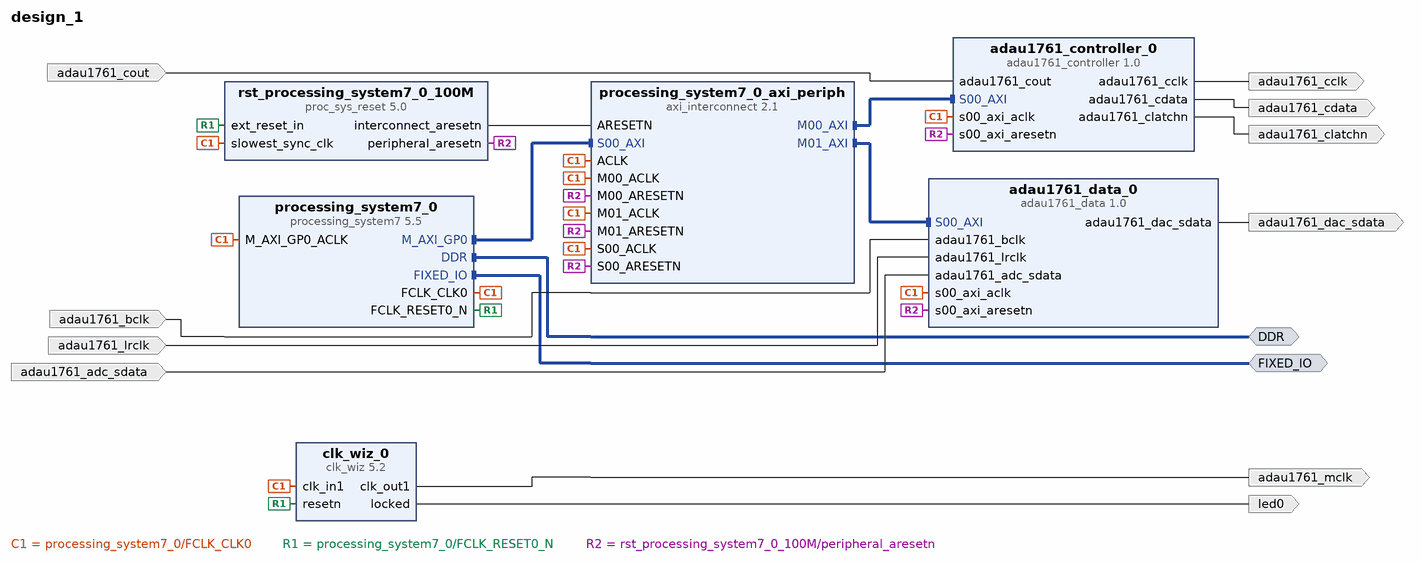
[diagram p0: block diagram of the top level]
# Vivado block design design_1, Vivado 2015.4
create_bd_design design_1

create_bd_intf_port -mode Master -vlnv xilinx.com:interface:ddrx_rtl:1.0 DDR
create_bd_intf_port -mode Master -vlnv xilinx.com:display_processing_system7:fixedio_rtl:1.0 FIXED_IO
create_bd_port -dir O adau1761_cclk
create_bd_port -dir O adau1761_clatchn
create_bd_port -dir O adau1761_cdata
create_bd_port -dir I adau1761_cout
create_bd_port -dir O adau1761_mclk
create_bd_port -dir O led0
create_bd_port -dir O adau1761_dac_sdata
create_bd_port -dir I adau1761_bclk
create_bd_port -dir I adau1761_lrclk
create_bd_port -dir I adau1761_adc_sdata

create_bd_cell -type ip -vlnv xilinx.com:ip:processing_system7:5.5 processing_system7_0
set_property -dict {CONFIG.preset ZedBoard} [get_bd_cells processing_system7_0]
create_bd_cell -type ip -vlnv xilinx.com:user:adau1761_controller:1.0 adau1761_controller_0
create_bd_cell -type ip -vlnv xilinx.com:ip:axi_interconnect:2.1 processing_system7_0_axi_periph
set_property -dict {CONFIG.NUM_MI 2} [get_bd_cells processing_system7_0_axi_periph]
create_bd_cell -type ip -vlnv xilinx.com:ip:proc_sys_reset:5.0 rst_processing_system7_0_100M
create_bd_cell -type ip -vlnv xilinx.com:ip:clk_wiz:5.2 clk_wiz_0
set_property -dict [list \
  CONFIG.CLKOUT1_REQUESTED_OUT_FREQ 24 \
  CONFIG.FEEDBACK_SOURCE FDBK_AUTO \
  CONFIG.RESET_PORT resetn \
  CONFIG.MMCM_DIVCLK_DIVIDE 5 \
  CONFIG.MMCM_CLKFBOUT_MULT_F 50.250 \
  CONFIG.MMCM_COMPENSATION ZHOLD \
  CONFIG.MMCM_CLKOUT0_DIVIDE_F 41.875 \
  CONFIG.RESET_TYPE ACTIVE_LOW \
  CONFIG.CLKOUT1_JITTER 305.592 \
  CONFIG.CLKOUT1_PHASE_ERROR 298.923 \
] [get_bd_cells clk_wiz_0]
create_bd_cell -type ip -vlnv xilinx.com:user:adau1761_data:1.0 adau1761_data_0

# ---- connections ----

connect_bd_intf_net [get_bd_intf_pins processing_system7_0/M_AXI_GP0] [get_bd_intf_pins processing_system7_0_axi_periph/S00_AXI]
connect_bd_intf_net [get_bd_intf_pins processing_system7_0_axi_periph/M00_AXI] [get_bd_intf_pins adau1761_controller_0/S00_AXI]
connect_bd_intf_net [get_bd_intf_pins processing_system7_0_axi_periph/M01_AXI] [get_bd_intf_pins adau1761_data_0/S00_AXI]
connect_bd_intf_net [get_bd_intf_ports DDR] [get_bd_intf_pins processing_system7_0/DDR]
connect_bd_intf_net [get_bd_intf_ports FIXED_IO] [get_bd_intf_pins processing_system7_0/FIXED_IO]
connect_bd_net [get_bd_pins processing_system7_0/FCLK_CLK0] \
  [get_bd_pins processing_system7_0/M_AXI_GP0_ACLK] [get_bd_pins processing_system7_0_axi_periph/S00_ACLK] \
  [get_bd_pins rst_processing_system7_0_100M/slowest_sync_clk] [get_bd_pins processing_system7_0_axi_periph/ACLK] \
  [get_bd_pins adau1761_controller_0/s00_axi_aclk] [get_bd_pins processing_system7_0_axi_periph/M00_ACLK] \
  [get_bd_pins clk_wiz_0/clk_in1] [get_bd_pins adau1761_data_0/s00_axi_aclk] \
  [get_bd_pins processing_system7_0_axi_periph/M01_ACLK]
connect_bd_net [get_bd_pins processing_system7_0/FCLK_RESET0_N] \
  [get_bd_pins rst_processing_system7_0_100M/ext_reset_in] [get_bd_pins clk_wiz_0/resetn]
connect_bd_net [get_bd_pins rst_processing_system7_0_100M/peripheral_aresetn] \
  [get_bd_pins processing_system7_0_axi_periph/S00_ARESETN] [get_bd_pins adau1761_controller_0/s00_axi_aresetn] \
  [get_bd_pins processing_system7_0_axi_periph/M00_ARESETN] [get_bd_pins adau1761_data_0/s00_axi_aresetn] \
  [get_bd_pins processing_system7_0_axi_periph/M01_ARESETN]
connect_bd_net [get_bd_pins rst_processing_system7_0_100M/interconnect_aresetn] [get_bd_pins processing_system7_0_axi_periph/ARESETN]
connect_bd_net [get_bd_pins adau1761_controller_0/adau1761_cclk] [get_bd_ports adau1761_cclk]
connect_bd_net [get_bd_pins adau1761_controller_0/adau1761_clatchn] [get_bd_ports adau1761_clatchn]
connect_bd_net [get_bd_pins adau1761_controller_0/adau1761_cdata] [get_bd_ports adau1761_cdata]
connect_bd_net [get_bd_ports adau1761_cout] [get_bd_pins adau1761_controller_0/adau1761_cout]
connect_bd_net [get_bd_pins clk_wiz_0/clk_out1] [get_bd_ports adau1761_mclk]
connect_bd_net [get_bd_pins clk_wiz_0/locked] [get_bd_ports led0]
connect_bd_net [get_bd_pins adau1761_data_0/adau1761_dac_sdata] [get_bd_ports adau1761_dac_sdata]
connect_bd_net [get_bd_ports adau1761_bclk] [get_bd_pins adau1761_data_0/adau1761_bclk]
connect_bd_net [get_bd_ports adau1761_lrclk] [get_bd_pins adau1761_data_0/adau1761_lrclk]
connect_bd_net [get_bd_ports adau1761_adc_sdata] [get_bd_pins adau1761_data_0/adau1761_adc_sdata]

# ---- address map ----
assign_bd_address -offset 0x43C00000 -range 64K -target_address_space [get_bd_addr_spaces processing_system7_0/Data] [get_bd_addr_segs adau1761_controller_0/S00_AXI/S00_AXI_reg]
assign_bd_address -offset 0x43C10000 -range 64K -target_address_space [get_bd_addr_spaces processing_system7_0/Data] [get_bd_addr_segs adau1761_data_0/S00_AXI/S00_AXI_reg]

validate_bd_design
save_bd_design
